# Altium schematic sheet 02_Power Diagram.SchDoc
size A3; SheetNumber: 2; SheetTotal: 6
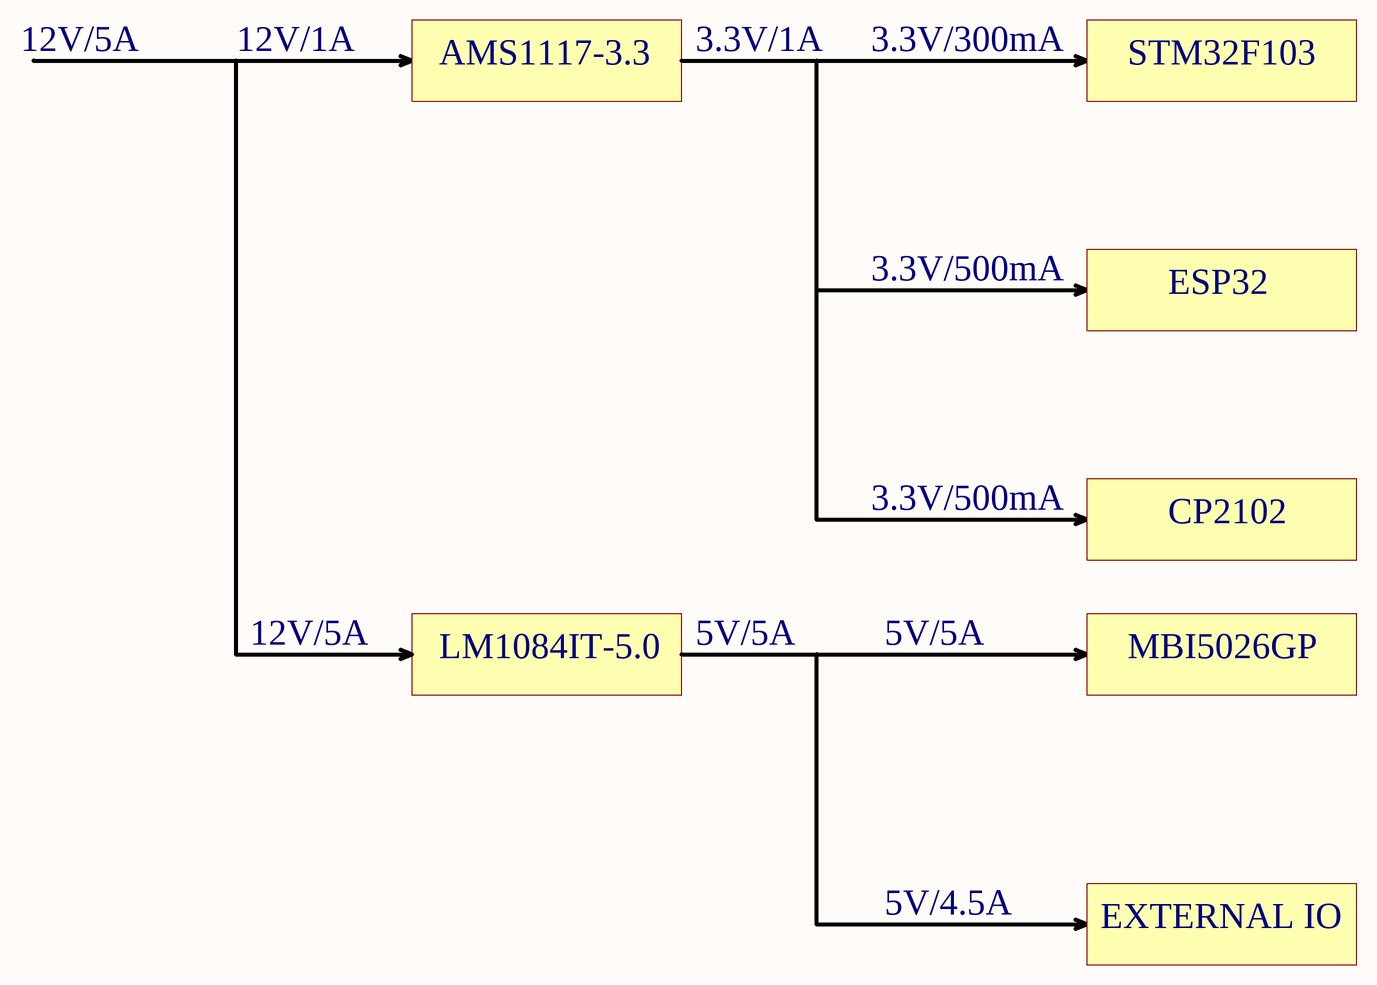
[diagram p0: 02_Power Diagram.SchDoc]

## Notes on the sheet
- 12V/5A
- 12V/1A
- AMS1117-3.3
- 3.3V/1A
- 3.3V/300mA
- STM32F103
- 3.3V/500mA
- ESP32
- CP2102
- LM1084IT-5.0
- 5V/5A
- MBI5026GP
- 5V/4.5A
- EXTERNAL IO